# EAGLE design soundpuddle_linedriver_mk1 (EAGLE 6.3)
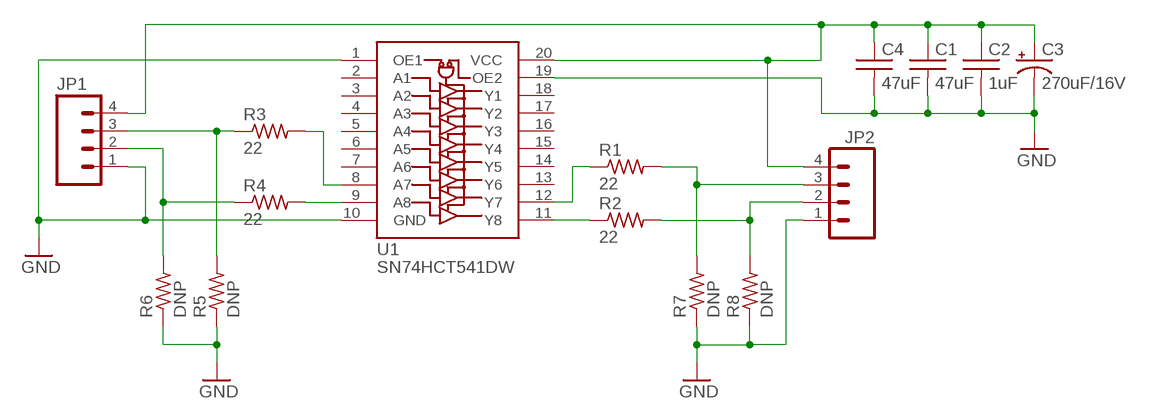
[diagram p0: schematic, sheet 1]

## Parts
C1  47uF  CAPACITORC_1206  [1206]
C2  1uF  CAPACITORC_0603  [0603]
C3  270uF/16V  CAPACITOR_ELEC8MM_DIA  [CAP_RADIAL_THRUHOLE_8MM_DIA]
C4  47uF  CAPACITORC_1206  [1206]
JP1  M04POLAR  [MOLEX-1X4]
JP2  M04POLAR  [MOLEX-1X4]
R1  22  RESISTORR_0805  [0805]
R2  22  RESISTORR_0805  [0805]
R3  22  RESISTORR_0805  [0805]
R4  22  RESISTORR_0805  [0805]
R5  DNP  RESISTORR_0805  [0805]
R6  DNP  RESISTORR_0805  [0805]
R7  DNP  RESISTORR_0805  [0805]
R8  DNP  RESISTORR_0805  [0805]
U1  SN74HCT541DW  [SOIC-20_TI_DW]

## Nets
GND: C1.P$2 C2.2 C3.P$1(-) C4.P$2 JP1.1 JP2.1 R5.1 R6.1 R7.1 R8.1 U1.1(OE1) U1.10(GND) U1.19(OE2)
N$1: C1.P$1 C2.1 C3.P$2(+) C4.P$1 JP1.4 JP2.4 U1.20(VCC)
N$2: JP1.2 R4.1 R6.2
N$3: JP1.3 R3.1 R5.2
N$4: R1.1 U1.12(Y7)
N$5: JP2.2 R2.2 R8.2
N$6: JP2.3 R1.2 R7.2
N$7: R2.1 U1.11(Y8)
N$8: R3.2 U1.8(A7)
N$9: R4.2 U1.9(A8)
Unconnected: U1.2(A1) U1.3(A2) U1.4(A3) U1.5(A4) U1.6(A5) U1.7(A6) U1.13(Y6) U1.14(Y5) U1.15(Y4) U1.16(Y3) U1.17(Y2) U1.18(Y1)

## Library data of the parts
C1 C2 C4 = 1_Dan Master:CAPACITOR: SMT Capacitor
C3 = 1_Dan Master:CAPACITOR_ELEC: Electrolytic Capacitor, SMT
JP1 JP2 = SparkFun-Connectors:M04: Header 4 Standard 4-pin 0.1" header. Use with straight break away headers (SKU : PRT-00116), right angle break away headers (PRT-00553), swiss pins (PRT-00743), machine pins (PRT-00117), and female headers (PRT-00115). Molex polarized connector foot print use with SKU : PRT-08231 with associated crimp pins and housings. 1MM SMD Version SKU: PRT-10208
R1-R8 = 1_Dan Master:RESISTOR: Resistor, Chip Mount, SMT
U1 = 1_Dan Master:SN74HCT541

## Board
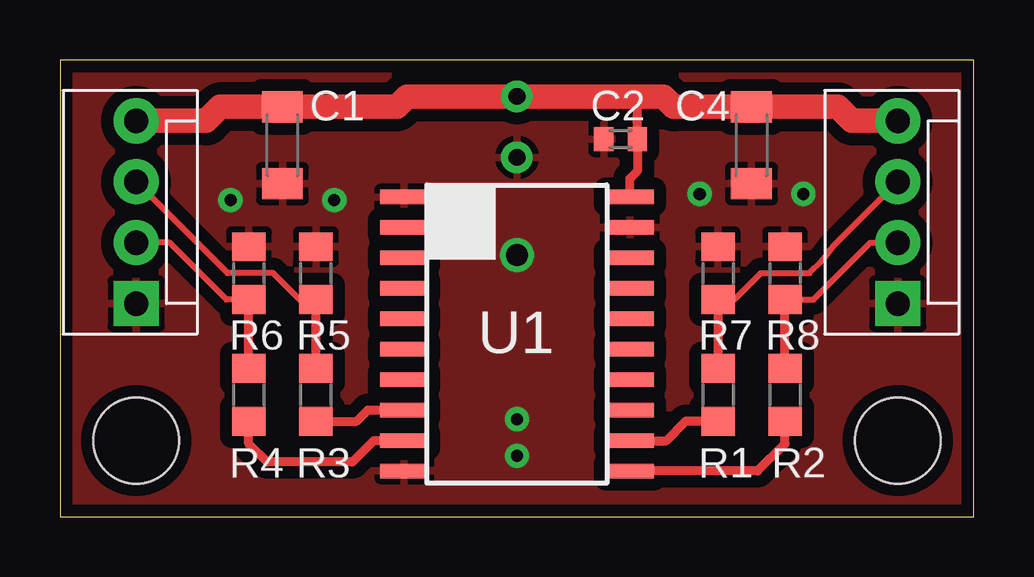
[diagram p1: board, top side]
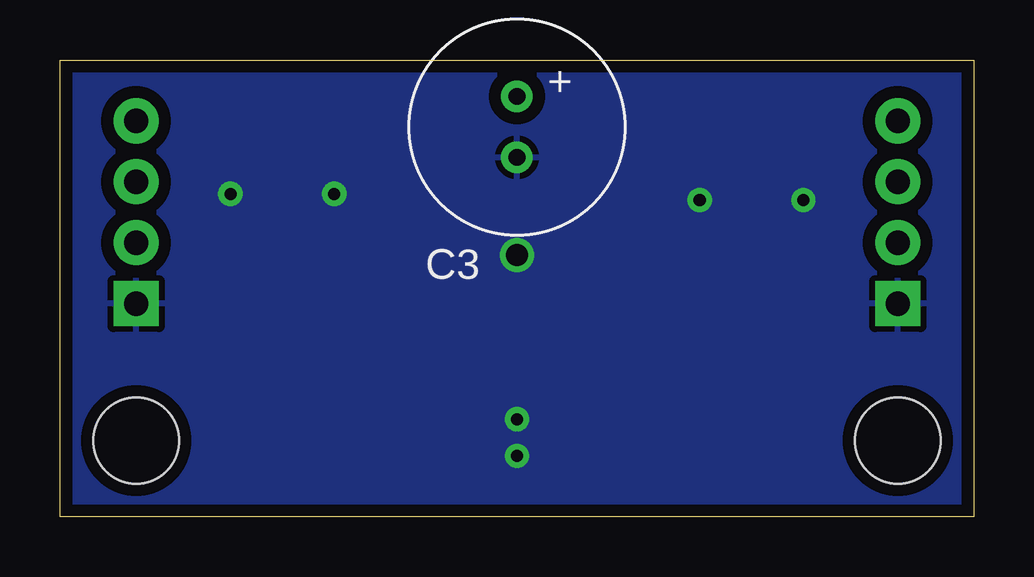
[diagram p2: board, bottom side, seen from below]

Size 38.1 x 19.05 mm. Coordinates in mm from the lower left corner, seen from the top.
Outline: 0,0 38.1,0 38.1,19.05 0,19.05 0,0
Copper layers (1*16): Top 0.035mm / dielectric 1.5mm / Bottom 0.035mm
Design rules "SparkFun-2-layer": minimum track width 7mil, minimum drill 15mil, track to track 8mil, track to pad 8mil, pad to pad 8mil, via to via 8mil, smd to smd 8mil, copper to edge 8mil, drill to drill 8mil, minimum pad ring 12mil, minimum via ring 10mil, stop-mask expansion 4mil, vias tented up to drill 20mil, thermal gap 10mil
Holes 3.58 mm at 3.17,3.17 34.92,3.17

### Footprints (pad centres in the part's own frame; a part is rotated, then mirrored left to right if it is on the bottom)
1206 = smd 1.3 x 1.7: P$1 -1.6,0; P$2 1.6,0
0603 = smd 0.8 x 1: 1 -0.7,0; 2 0.7,0
CAP_RADIAL_THRUHOLE_8MM_DIA = drill 0.7: P$1 0,-1.27; P$2 0,1.27
MOLEX-1X4 = drill 1.016 pad 1.88 square: 1 0,0 | drill 1.016 pad 1.88: 2 2.54,0; 3 5.08,0; 4 7.62,0
0805 = smd 1.2 x 1.4: 1 -1.1,0; 2 1.1,0
SOIC-20_TI_DW = smd 0.6 x 2: 1 -5.715,-4.7; 2 -4.445,-4.7; 3 -3.175,-4.7; 4 -1.905,-4.7; 5 -0.635,-4.7; 6 0.635,-4.7; 7 1.905,-4.7; 8 3.175,-4.7; 9 4.445,-4.7; 10 5.715,-4.7; 11 5.715,4.7; 12 4.445,4.7; 13 3.175,4.7; 14 1.905,4.7; 15 0.635,4.7; 16 -0.635,4.7; 17 -1.905,4.7; 18 -3.175,4.7; 19 -4.445,4.7; 20 -5.715,4.7

### Placement (x,y rotation side)
C1  9.27,15.49 270 top
C2  23.37,15.75 180 top
C3  19.05,16.26 0 bottom
C4  28.83,15.49 270 top
JP1  3.17,8.89 90 top
JP2  34.92,8.89 90 top
R1  27.43,5.08 90 top
R2  30.23,5.08 90 top
R3  10.67,5.08 270 top
R4  7.87,5.08 270 top
R5  10.67,10.16 270 top
R6  7.87,10.16 270 top
R7  27.43,10.16 270 top
R8  30.23,10.16 270 top
U1  19.05,7.62 270 top

### Tracks (layer width: path | path; a pad name or v marks a point on that pad's centre or on a via)
GND  (via drill 0.51, 0.91)
  other vias: 30.99,13.46 26.67,13.46 11.43,13.21 7.11,13.21 19.05,2.54 19.05,4.06 19.05,10.92
  pour Top (isolate 0.508, rank 6): 0.25,18.8 37.59,18.8 37.59,0.25 0.25,0.25
  pour Bottom (isolate 0.508, rank 6): 0.25,18.8 37.59,18.8 37.59,0.25 0.25,0.25
N$1
  Top 0.381: U1.20 23.75,14.1 24.07,14.42 C2.1 24.07,17.46 24.13,17.53
  Top 1.016: JP2.4 33.02,16.51 32.44,17.09 C4.P$1 25.58,17.09 25.15,17.53 24.13,17.53 C3.P$2 14.48,17.53 14.05,17.09 C1.P$1 6.68,17.09 6.1,16.51 JP1.4
N$2
  Top 0.254: R6.2 6.94,9.06 4.57,11.43 JP1.2
  Top 0.381: R4.1 R6.2
N$3
  Top 0.254: R5.2 9.99,9.06 8.89,10.16 6.99,10.16 JP1.3
  Top 0.381: R3.1 R5.2
N$4
  Top 0.381: U1.12 25.27,3.17 26.08,3.98 R1.1
N$5
  Top 0.254: R8.2 31.41,9.06 33.78,11.43 JP2.2
  Top 0.381: R2.2 R8.2
N$6
  Top 0.254: R7.2 28.11,9.06 29.21,10.16 31.24,10.16 31.75,10.67 32.26,11.3 JP2.3
  Top 0.381: R7.2 R1.2
N$7
  Top 0.381: U1.11 29.08,1.91 30.23,3.05 R2.1
N$8
  Top 0.381: R3.2 12.36,3.98 12.83,4.45 U1.8
N$9
  Top 0.381: U1.9 13.08,3.17 12.19,2.29 8.64,2.29 7.87,3.05 R4.2